# EAGLE design nRF_board (EAGLE 6.5.0)
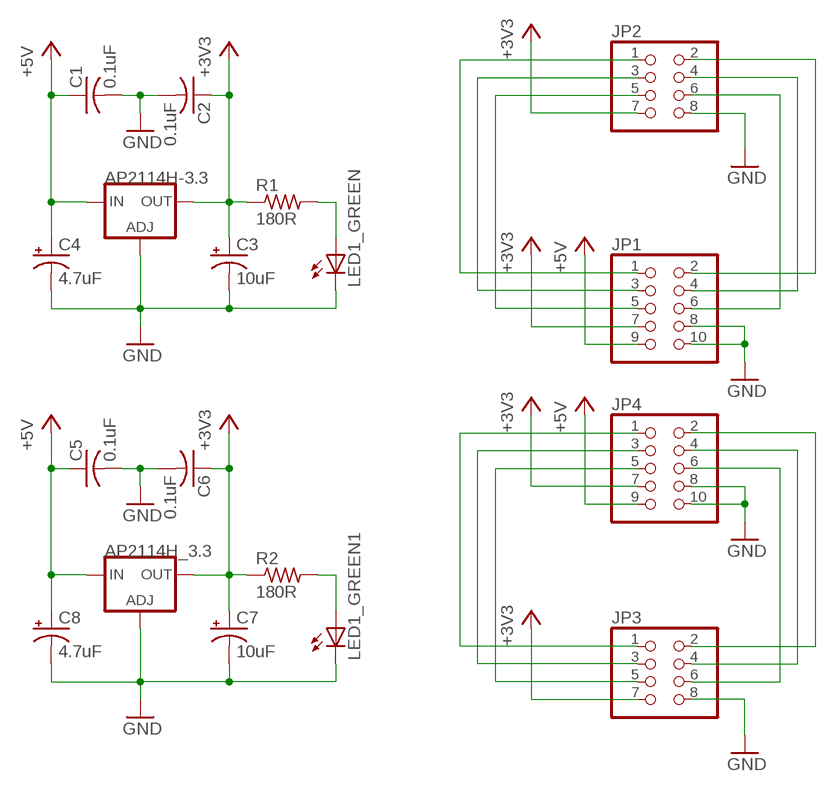
[diagram p0: schematic, sheet 1]

## Parts
AP2114H-3.3  LD117AS28TR  [SOT223]
AP2114H_3.3  LD117AS28TR  [SOT223]
C1  0.1uF  C-USC1206K  [C1206K]
C2  0.1uF  C-USC1206K  [C1206K]
C3  10uF  CPOL-USE2-5  [E2-5]
C4  4.7uF  CPOL-USE2-5  [E2-5]
C5  0.1uF  C-USC1206K  [C1206K]
C6  0.1uF  C-USC1206K  [C1206K]
C7  10uF  CPOL-USE2-5  [E2-5]
C8  4.7uF  CPOL-USE2-5  [E2-5]
JP1  PINHD-2X5  [2X05]
JP2  PINHD-2X4  [2X04]
JP3  PINHD-2X4  [2X04]
JP4  PINHD-2X5  [2X05]
LED1_GREEN  LEDSMT1206  [1206]
LED1_GREEN1  LEDSMT1206  [1206]
R1  180R  R-US_R1206  [R1206]
R2  180R  R-US_R1206  [R1206]

## Nets
+3V3: AP2114H-3.3.4(OUT) AP2114H_3.3.4(OUT) C2.1 C3.+ C6.1 C7.+ JP1.7 JP2.7 JP3.7 JP4.7 R1.1 R2.1
+5V: AP2114H-3.3.3(IN) AP2114H_3.3.3(IN) C1.1 C4.+ C5.1 C8.+ JP1.9 JP4.9
GND: AP2114H-3.3.1(ADJ) AP2114H_3.3.1(ADJ) C1.2 C2.2 C3.- C4.- C5.2 C6.2 C7.- C8.- JP1.8 JP1.10 JP2.8 JP3.8 JP4.8 JP4.10 LED1_GREEN1.C LED1_GREEN.C
N$1: LED1_GREEN1.A R2.2
N$2: JP1.5 JP2.5
N$3: LED1_GREEN.A R1.2
N$4: JP1.3 JP2.3
N$5: JP1.1 JP2.1
N$6: JP1.6 JP2.6
N$7: JP1.4 JP2.4
N$8: JP1.2 JP2.2
N$9: JP3.5 JP4.5
N$10: JP3.3 JP4.3
N$11: JP3.1 JP4.1
N$12: JP3.6 JP4.6
N$13: JP3.4 JP4.4
N$14: JP3.2 JP4.2

## Library data of the parts
AP2114H-3.3 AP2114H_3.3 = v-reg:LD117A?*: Low drop fixed and adjustable positive voltage regulators 1 A Source: http://www.st.com/stonline/products/literature/ds/7194/ld1117axx.pdf
C1 C2 C5 C6 = rcl:C-US: CAPACITOR, American symbol
C3 C4 C7 C8 = rcl:CPOL-US: POLARIZED CAPACITOR, American symbol
JP1 JP4 = pinhead:PINHD-2X5: PIN HEADER
JP2 JP3 = pinhead:PINHD-2X4: PIN HEADER
LED1_GREEN LED1_GREEN1 = led:LED: LED OSRAM: - CHIPLED LG R971, LG N971, LY N971, LG Q971, LY Q971, LO R971, LY R971 LH N974, LH R974 LS Q976, LO Q976, LY Q976 LO Q996 - Hyper CHIPLED LW Q18S LB Q993, LB Q99A, LB R99A - SideLED LS A670, LO A670, LY A670, LG A670, LP A670 LB A673, LV A673, LT A673, LW A673 LH A674 LY A675 LS A676, LA A676, LO A676, LY A676, LW A676 LS A679, LY A679, LG A679 - Hyper Micro SIDELED® LS Y876, LA Y876, LO Y876, LY Y876 LT Y87S - SmartLED LW L88C, LW L88S LB L89C, LB L89S, LG L890 LS L89K, LO L89K, LY L89K LS L896, LA L896, LO L896, LY L896 - TOPLED LS T670, LO T670, LY T670, LG T670, LP T670 LSG T670, LSP T670, LSY T670, LOP T670, LYG T670 LG T671, LOG T671, LSG T671 LB T673, LV T673, LT T673, LW T673 LH T674 LS T676, LA T676, LO T676, LY T676, LB T676, LH T676, LSB T676, LW T676 LB T67C, LV T67C, LT T67C, LS T67K, LO T67K, LY T67K, LW E67C LS E67B, LA E67B, LO E67B, LY E67B, LB E67C, LV E67C, LT E67C LW T67C LS T679, LY T679, LG T679 LS T770, LO T770, LY T770, LG T770, LP T770 LB T773, LV T773, LT T773, LW T773 LH T774 LS E675, LA E675, LY E675, LS T675 LS T776, LA T776, LO T776, LY T776, LB T776 LHGB T686 LT T68C, LB T68C - Hyper Mini TOPLED® LB M676 - Mini TOPLED Santana® LG M470 LS M47K, LO M47K, LY M47K Source: http://www.osram.convergy.de LUXEON: - LUMILED® LXK2-PW12-R00, LXK2-PW12-S00, LXK2-PW14-U00, LXK2-PW14-V00 LXK2-PM12-R00, LXK2-PM12-S00, LXK2-PM14-U00 LXK2-PE12-Q00, LXK2-PE12-R00, LXK2-PE12-S00, LXK2-PE14-T00, LXK2-PE14-U00 LXK2-PB12-K00, LXK2-PB12-L00, LXK2-PB12-M00, LXK2-PB14-N00, LXK2-PB14-P00, LXK2-PB14-Q00 LXK2-PR12-L00, LXK2-PR12-M00, LXK2-PR14-Q00, LXK2-PR14-R00 LXK2-PD12-Q00, LXK2-PD12-R00, LXK2-PD12-S00 LXK2-PH12-R00, LXK2-PH12-S00 LXK2-PL12-P00, LXK2-PL12-Q00, LXK2-PL12-R00 Source: www.luxeon.com KINGBRIGHT: KA-3528ASYC Source: www.kingbright.com
R1 R2 = rcl:R-US_: RESISTOR, American symbol

## Board
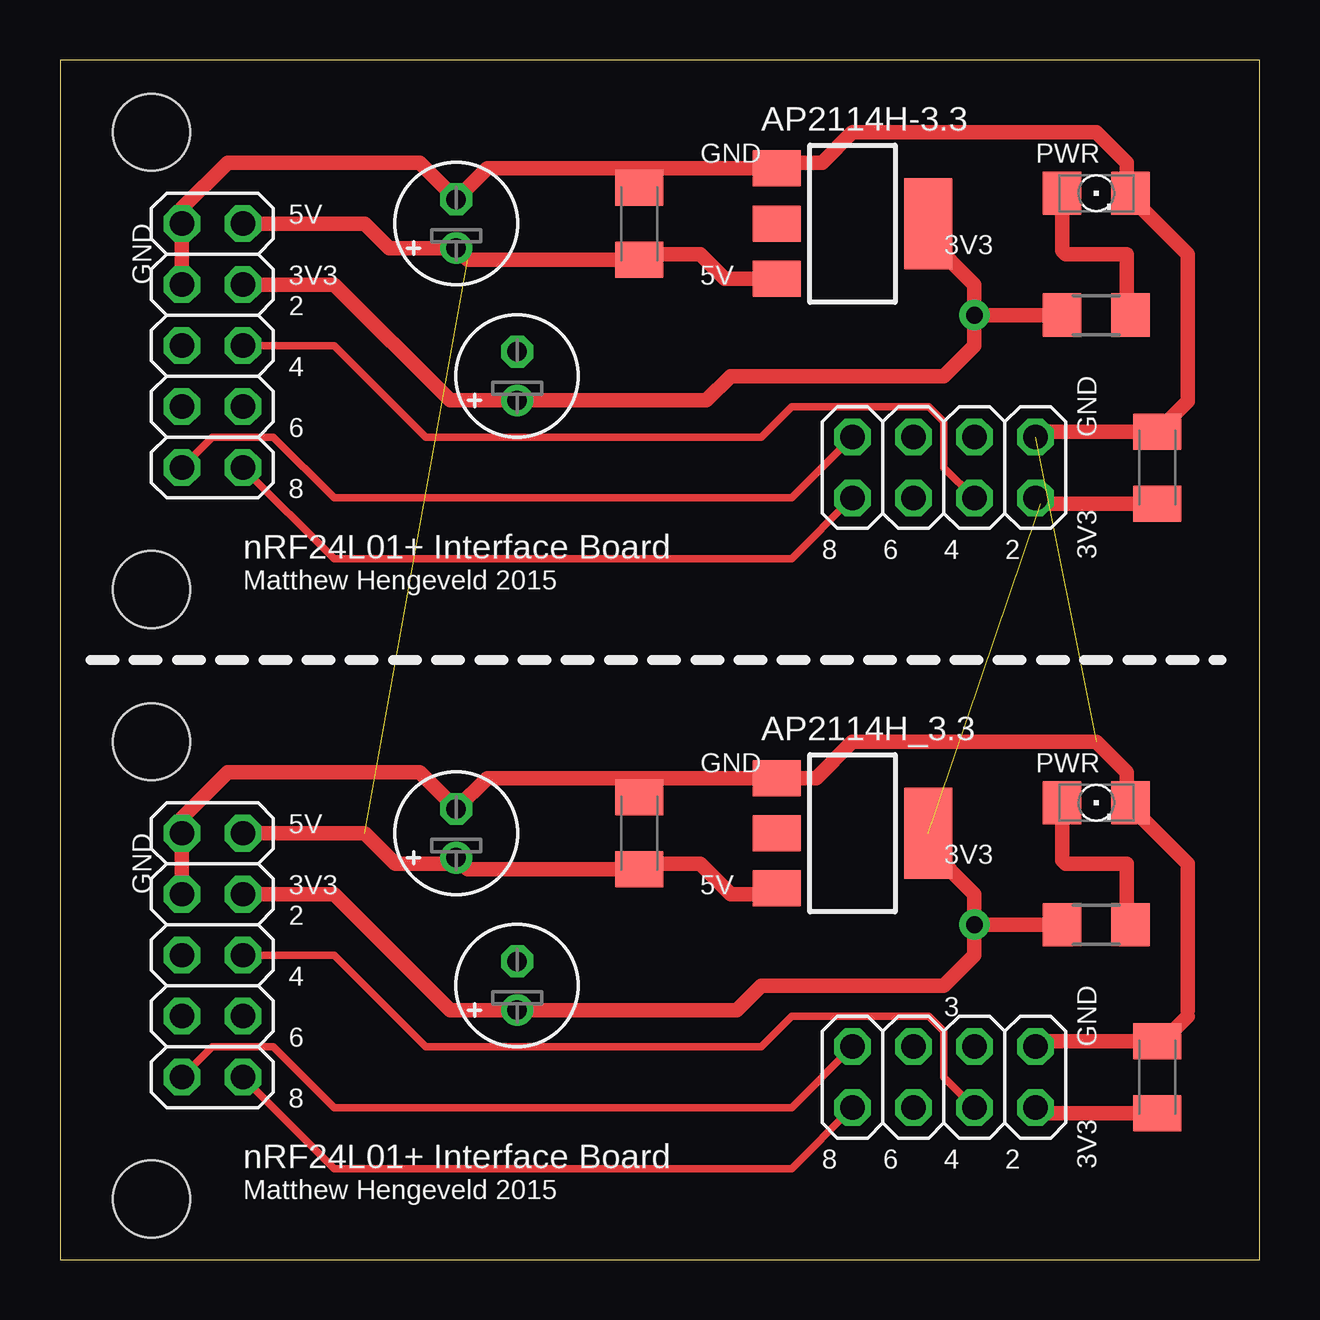
[diagram p1: board, top side]
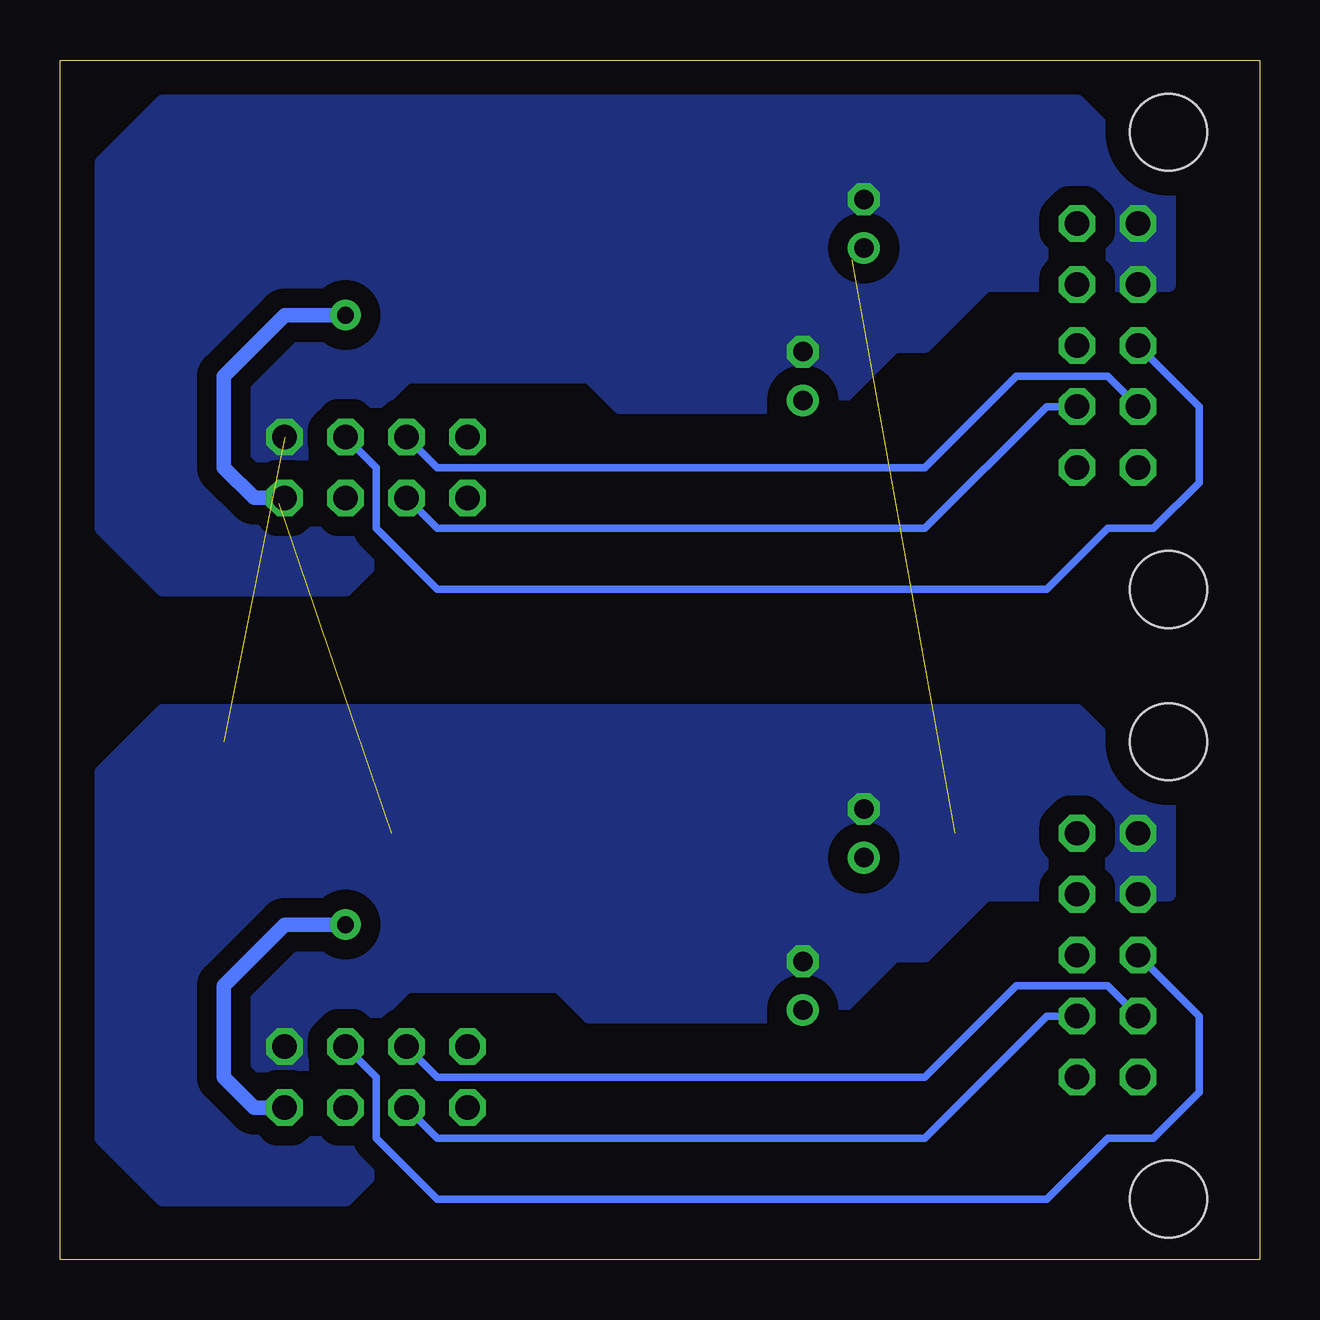
[diagram p2: board, bottom side, seen from below]

Size 50 x 50 mm. Coordinates in mm from the lower left corner, seen from the top.
Outline: 0,0 50,0 50,50 0,50 0,0
Copper layers (1*16): Top 0.035mm / dielectric 1.5mm / Bottom 0.035mm
Design rules "default": minimum track width 10mil, minimum drill 24mil, track to track 8mil, track to pad 8mil, pad to pad 8mil, via to via 8mil, smd to smd 8mil, copper to edge 40mil, drill to drill 8mil, minimum pad ring 10mil, minimum via ring 8mil, stop-mask expansion 4mil, vias tented up to drill 0mil, thermal gap 10mil
Holes 3.2 mm at 3.81,21.59 3.81,2.54 3.81,27.94 3.81,46.99

### Footprints (pad centres in the part's own frame; a part is rotated, then mirrored left to right if it is on the bottom)
SOT223 = smd 1.5 x 2: 1 -2.3,-3.15; 2 0,-3.15; 3 2.3,-3.15 | smd 3.8 x 2: 4 0,3.15
C1206K = smd 1.5 x 2: 1 -1.5,0; 2 1.5,0
E2-5 = drill 0.813 pad 1.27: + -1.016,0 | drill 0.813 pad 1.27 octagon: - 1.016,0
2X05 = drill 1.016 octagon: 1 -5.08,-1.27; 2 -5.08,1.27; 3 -2.54,-1.27; 4 -2.54,1.27; 5 0,-1.27; 6 0,1.27; 7 2.54,-1.27; 8 2.54,1.27; 9 5.08,-1.27; 10 5.08,1.27
2X04 = drill 1.016 octagon: 1 -3.81,-1.27; 2 -3.81,1.27; 3 -1.27,-1.27; 4 -1.27,1.27; 5 1.27,-1.27; 6 1.27,1.27; 7 3.81,-1.27; 8 3.81,1.27
1206 = smd 1.6 x 1.803: A -1.422,0; C 1.422,0
R1206 = smd 1.6 x 1.803: 1 -1.422,0; 2 1.422,0

### Placement (x,y rotation side)
AP2114H-3.3  33.02,43.18 270 top
AP2114H_3.3  33.02,17.78 270 top
C1  24.13,43.18 90 top
C2  45.72,33.02 90 top
C3  19.05,36.83 90 top
C4  16.51,43.18 90 top
C5  24.13,17.78 90 top
C6  45.72,7.62 90 top
C7  19.05,11.43 90 top
C8  16.51,17.78 90 top
JP1  6.35,38.1 90 top
JP2  36.83,33.02 0 top
JP3  36.83,7.62 0 top
JP4  6.35,12.7 90 top
LED1_GREEN  43.18,44.45 0 top
LED1_GREEN1  43.18,19.05 0 top
R1  43.18,39.37 0 top
R2  43.18,13.97 0 top

### Tracks (layer width: path | path; a pad name or v marks a point on that pad's centre or on a via)
+3V3  (via drill 0.7 pad 1.27)  (1 unrouted)
  Top 0.61: AP2114H_3.3.4 36.17,17.17 38.1,15.24 v38.1,13.97 | AP2114H-3.3.4 36.17,42.57 38.1,40.64 v38.1,39.37 | v38.1,13.97 38.1,12.7 36.83,11.43 29.21,11.43 28.19,10.41 C7.+ 16.26,10.41 11.43,15.24 JP4.7 | v38.1,39.37 38.1,38.1 36.83,36.83 27.94,36.83 26.92,35.81 C3.+ 16.26,35.81 11.43,40.64 JP1.7 | R1.1 v38.1,39.37 | R2.1 v38.1,13.97 | C6.1 40.87,6.12 JP3.7 | C2.1 40.87,31.52 JP2.7
  Bottom 0.61: JP2.7 41.91,31.75 43.18,33.02 43.18,36.83 40.64,39.37 v38.1,39.37 | JP3.7 41.91,6.35 43.18,7.62 43.18,11.43 40.64,13.97 v38.1,13.97
+5V  (1 unrouted)
  Top 0.61: AP2114H_3.3.3 29.45,15.48 29.21,15.24 27.94,15.24 26.67,16.51 24.36,16.51 C5.1 16.99,16.28 C8.+ 16.26,16.51 13.97,16.51 12.7,17.78 JP4.9 | AP2114H-3.3.3 27.7,40.88 26.67,41.91 24.36,41.91 C1.1 16.99,41.68 C4.+ 13.72,42.16 12.7,43.18 JP1.9
GND  (1 unrouted)
  Top 0.61: JP1.8 JP1.10 5.08,43.81 6.99,45.72 14.99,45.72 C4.- 17.79,45.48 24.13,45.48 | JP4.8 JP4.10 5.08,18.41 6.99,20.32 14.99,20.32 C8.- 17.79,20.08 24.13,20.08 | 24.13,20.08 AP2114H_3.3.1 31.51,20.08 33.02,21.59 43.18,21.59 44.45,20.32 44.45,19.2 LED1_GREEN1.C 44.6,18.9 46.99,16.51 46.99,10.39 | 24.13,45.48 AP2114H-3.3.1 29.45,45.48 29.21,45.72 31.75,45.72 33.02,46.99 43.18,46.99 44.45,45.72 44.45,44.6 LED1_GREEN.C 44.6,44.3 46.99,41.91 46.99,35.79 C2.2 40.87,34.52 JP2.8 | C5.2 24.13,20.08 | C1.2 24.13,45.48 | C6.2 40.87,9.12 JP3.8
  pour Bottom (isolate 0.813, no thermals): 7.62,48.26 3.81,44.45 3.81,40.64 11.43,40.64 13.97,38.1 15.24,38.1 17.78,35.56 26.67,35.56 27.94,36.83 35.56,36.83 36.83,35.56 36.83,29.21 38.1,27.94 45.72,27.94 48.26,30.48 48.26,45.72 45.72,48.26
  pour Bottom (isolate 0.813, no thermals): 7.62,22.86 3.81,19.05 3.81,15.24 11.43,15.24 13.97,12.7 15.24,12.7 17.78,10.16 27.94,10.16 29.21,11.43 35.56,11.43 36.83,10.16 36.83,3.81 38.1,2.54 45.72,2.54 48.26,5.08 48.26,20.32 45.72,22.86
N$1
  Top 0.61: LED1_GREEN1.A 41.76,16.66 41.91,16.51 44.45,16.51 44.45,14.12 R2.2
N$2
  Top 0.305: JP1.5 11.43,38.1 15.24,34.29 29.21,34.29 30.48,35.56 36.2,35.56 36.83,34.92 36.83,33.02 JP2.5
N$3
  Top 0.61: LED1_GREEN.A 41.76,42.06 41.91,41.91 44.45,41.91 44.45,39.52 R1.2
N$4
  Bottom 0.305: JP1.3 8.89,35.56 13.97,30.48 34.29,30.48 JP2.3
N$5
  Top 0.305: JP1.1 11.43,29.21 30.48,29.21 JP2.1
N$6
  Bottom 0.305: JP1.6 2.54,35.56 2.54,32.38 4.45,30.48 6.35,30.48 8.89,27.94 34.29,27.94 36.83,30.48 36.83,33.02 JP2.6
N$7
  Bottom 0.305: JP1.4 6.35,36.83 10.16,36.83 13.97,33.02 34.29,33.02 JP2.4
N$8
  Top 0.305: JP2.2 30.48,31.75 11.43,31.75 8.89,34.29 6.35,34.29 JP1.2
N$9
  Top 0.305: JP4.5 11.43,12.7 15.24,8.89 29.21,8.89 30.48,10.16 36.2,10.16 36.83,9.53 36.83,7.62 JP3.5
N$10
  Bottom 0.305: JP4.3 8.89,10.16 13.97,5.08 34.29,5.08 JP3.3
N$11
  Top 0.305: JP4.1 11.43,3.81 30.48,3.81 JP3.1
N$12
  Bottom 0.305: JP4.6 2.54,10.16 2.54,6.99 4.45,5.08 6.35,5.08 8.89,2.54 34.29,2.54 36.83,5.08 36.83,7.62 JP3.6
N$13
  Bottom 0.305: JP4.4 6.35,11.43 10.16,11.43 13.97,7.62 34.29,7.62 JP3.4
N$14
  Top 0.305: JP4.2 6.35,8.89 8.89,8.89 11.43,6.35 30.48,6.35 JP3.2
N$15
  Top 0.61: 46.99,10.16 45.72,8.89

### Text on the board
tPlace: GND | PWR | 5V | 3V3 | GND | 3V3 | 5V | 2 | 4 | 6 | GND | 8 | nRF24L01+ Interface Board | 8 | 6 | 4 | 2 | 3V3 | Matthew Hengeveld 2015 | GND | PWR | 5V | 3V3 | GND | 3V3 | 5V | 2 | 4 | 3 | 6 | GND | 8 | nRF24L01+ Interface Board | 8 | 6 | 4 | 2 | 3V3 | Matthew Hengeveld 2015